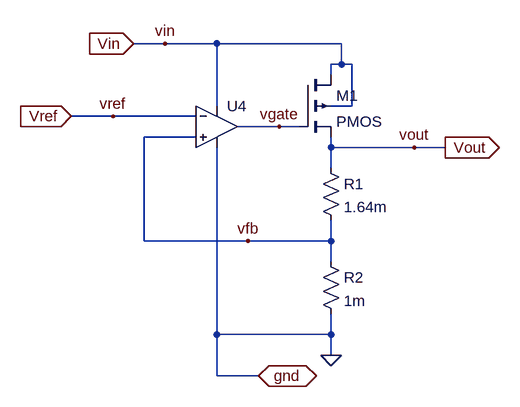
[diagram p0: schematic LDO_basic.asc]
LDO_basic.asc, the LTspice schematic file:
Version 4
SHEET 1 904 680
WIRE 112 48 64 48
WIRE 192 48 112 48
WIRE 384 48 192 48
WIRE 384 80 384 48
WIRE 384 80 368 80
WIRE 400 80 384 80
WIRE 368 96 368 80
WIRE 192 144 192 48
WIRE 400 144 400 80
WIRE 400 144 368 144
WIRE 32 160 -32 160
WIRE 160 160 32 160
WIRE 288 176 224 176
WIRE 320 176 288 176
WIRE 160 192 80 192
WIRE 368 208 368 192
WIRE 496 208 368 208
WIRE 544 208 496 208
WIRE 368 240 368 208
WIRE 80 352 80 192
WIRE 240 352 80 352
WIRE 368 352 368 320
WIRE 368 352 240 352
WIRE 368 384 368 352
WIRE 192 496 192 208
WIRE 368 496 368 464
WIRE 368 496 192 496
WIRE 368 528 368 496
WIRE 192 560 192 496
WIRE 256 560 192 560
FLAG 32 160 vref
FLAG 496 208 vout
FLAG 288 176 vgate
FLAG 240 352 vfb
FLAG 64 48 Vin
IOPIN 64 48 In
FLAG 112 48 vin
FLAG -32 160 Vref
IOPIN -32 160 In
FLAG 544 208 Vout
IOPIN 544 208 Out
FLAG 256 560 gnd
IOPIN 256 560 BiDir
FLAG 368 528 0
SYMBOL pmos4 320 96 R0
SYMATTR InstName M1
SYMATTR Value2 l=180n w=100u m=10000
SYMBOL res 352 224 R0
SYMATTR InstName R1
SYMATTR Value 1.64m
SYMBOL res 352 368 R0
SYMATTR InstName R2
SYMATTR Value 1m
SYMBOL OpAmps\\UniversalOpAmp 192 176 R0
SYMATTR InstName U4
SYMATTR Value2 Avol=400000 GBW=10Meg Vos=0

The netlist it stands for:
* LDO_basic.asc
M1 Vin vgate vout Vin PMOS l=180n w=100u m=10000
R1 vout vfb 1.64m
R2 vfb 0 1m
XU4 vfb vref Vin 0 vgate level1 Avol=400000 GBW=10Meg Vos=0 En=0 Enk=0 In=0 Ink=0 Rin=500Meg  ; pins In+ In- V+ V- OUT
.model NMOS NMOS
.model PMOS PMOS
.lib standard.mos
.lib UniversalOpAmp1.lib
.backanno
.end